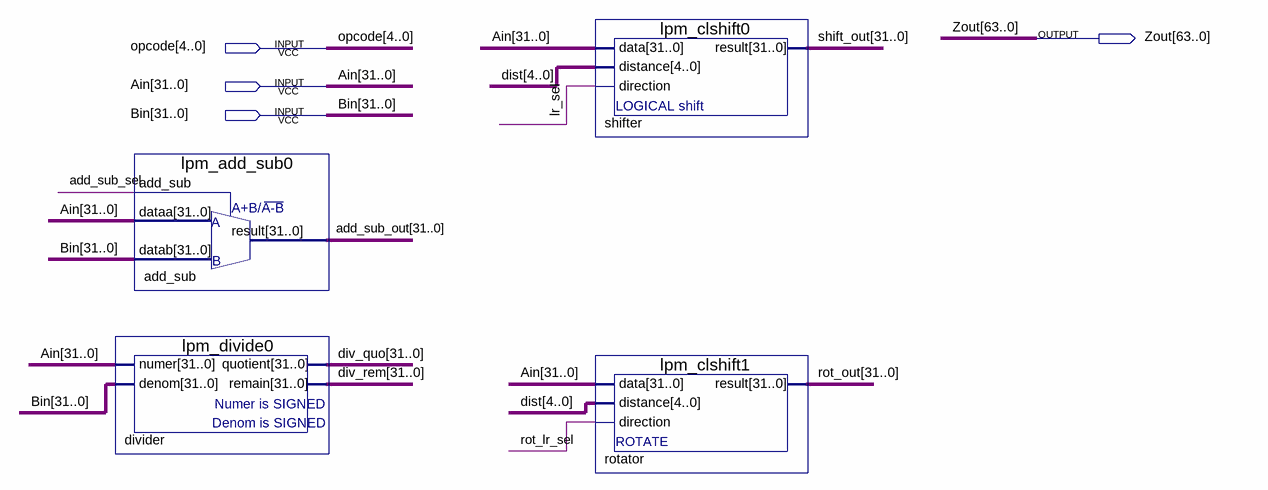
[diagram p0: schematic sheet]
// Quartus schematic ALU.bdf as structural Verilog: 4 symbols, 4 pins
module ALU (
  input  [4:0] opcode,
  input  [31:0] Ain,
  input  [31:0] Bin,
  output [63:0] Zout
);

  wire add_sub_sel, lr_sel, rot_lr_sel;
  wire [4:0] \dist ;
  wire [31:0] add_sub_out, div_quo, div_rem, rot_out, shift_out;

  lpm_add_sub0 add_sub (.add_sub(add_sub_sel), .dataa(Ain), .datab(Bin), .result(add_sub_out));
  lpm_divide0 divider (.numer(Ain), .denom(Bin), .quotient(div_quo), .remain(div_rem));
  lpm_clshift0 shifter (.data(Ain), .distance(\dist ), .direction(lr_sel), .result(shift_out));
  lpm_clshift1 rotator (.data(Ain), .distance(\dist ), .direction(rot_lr_sel), .result(rot_out));
endmodule
